# Altium schematic sheet Top2.SchDoc
size A3
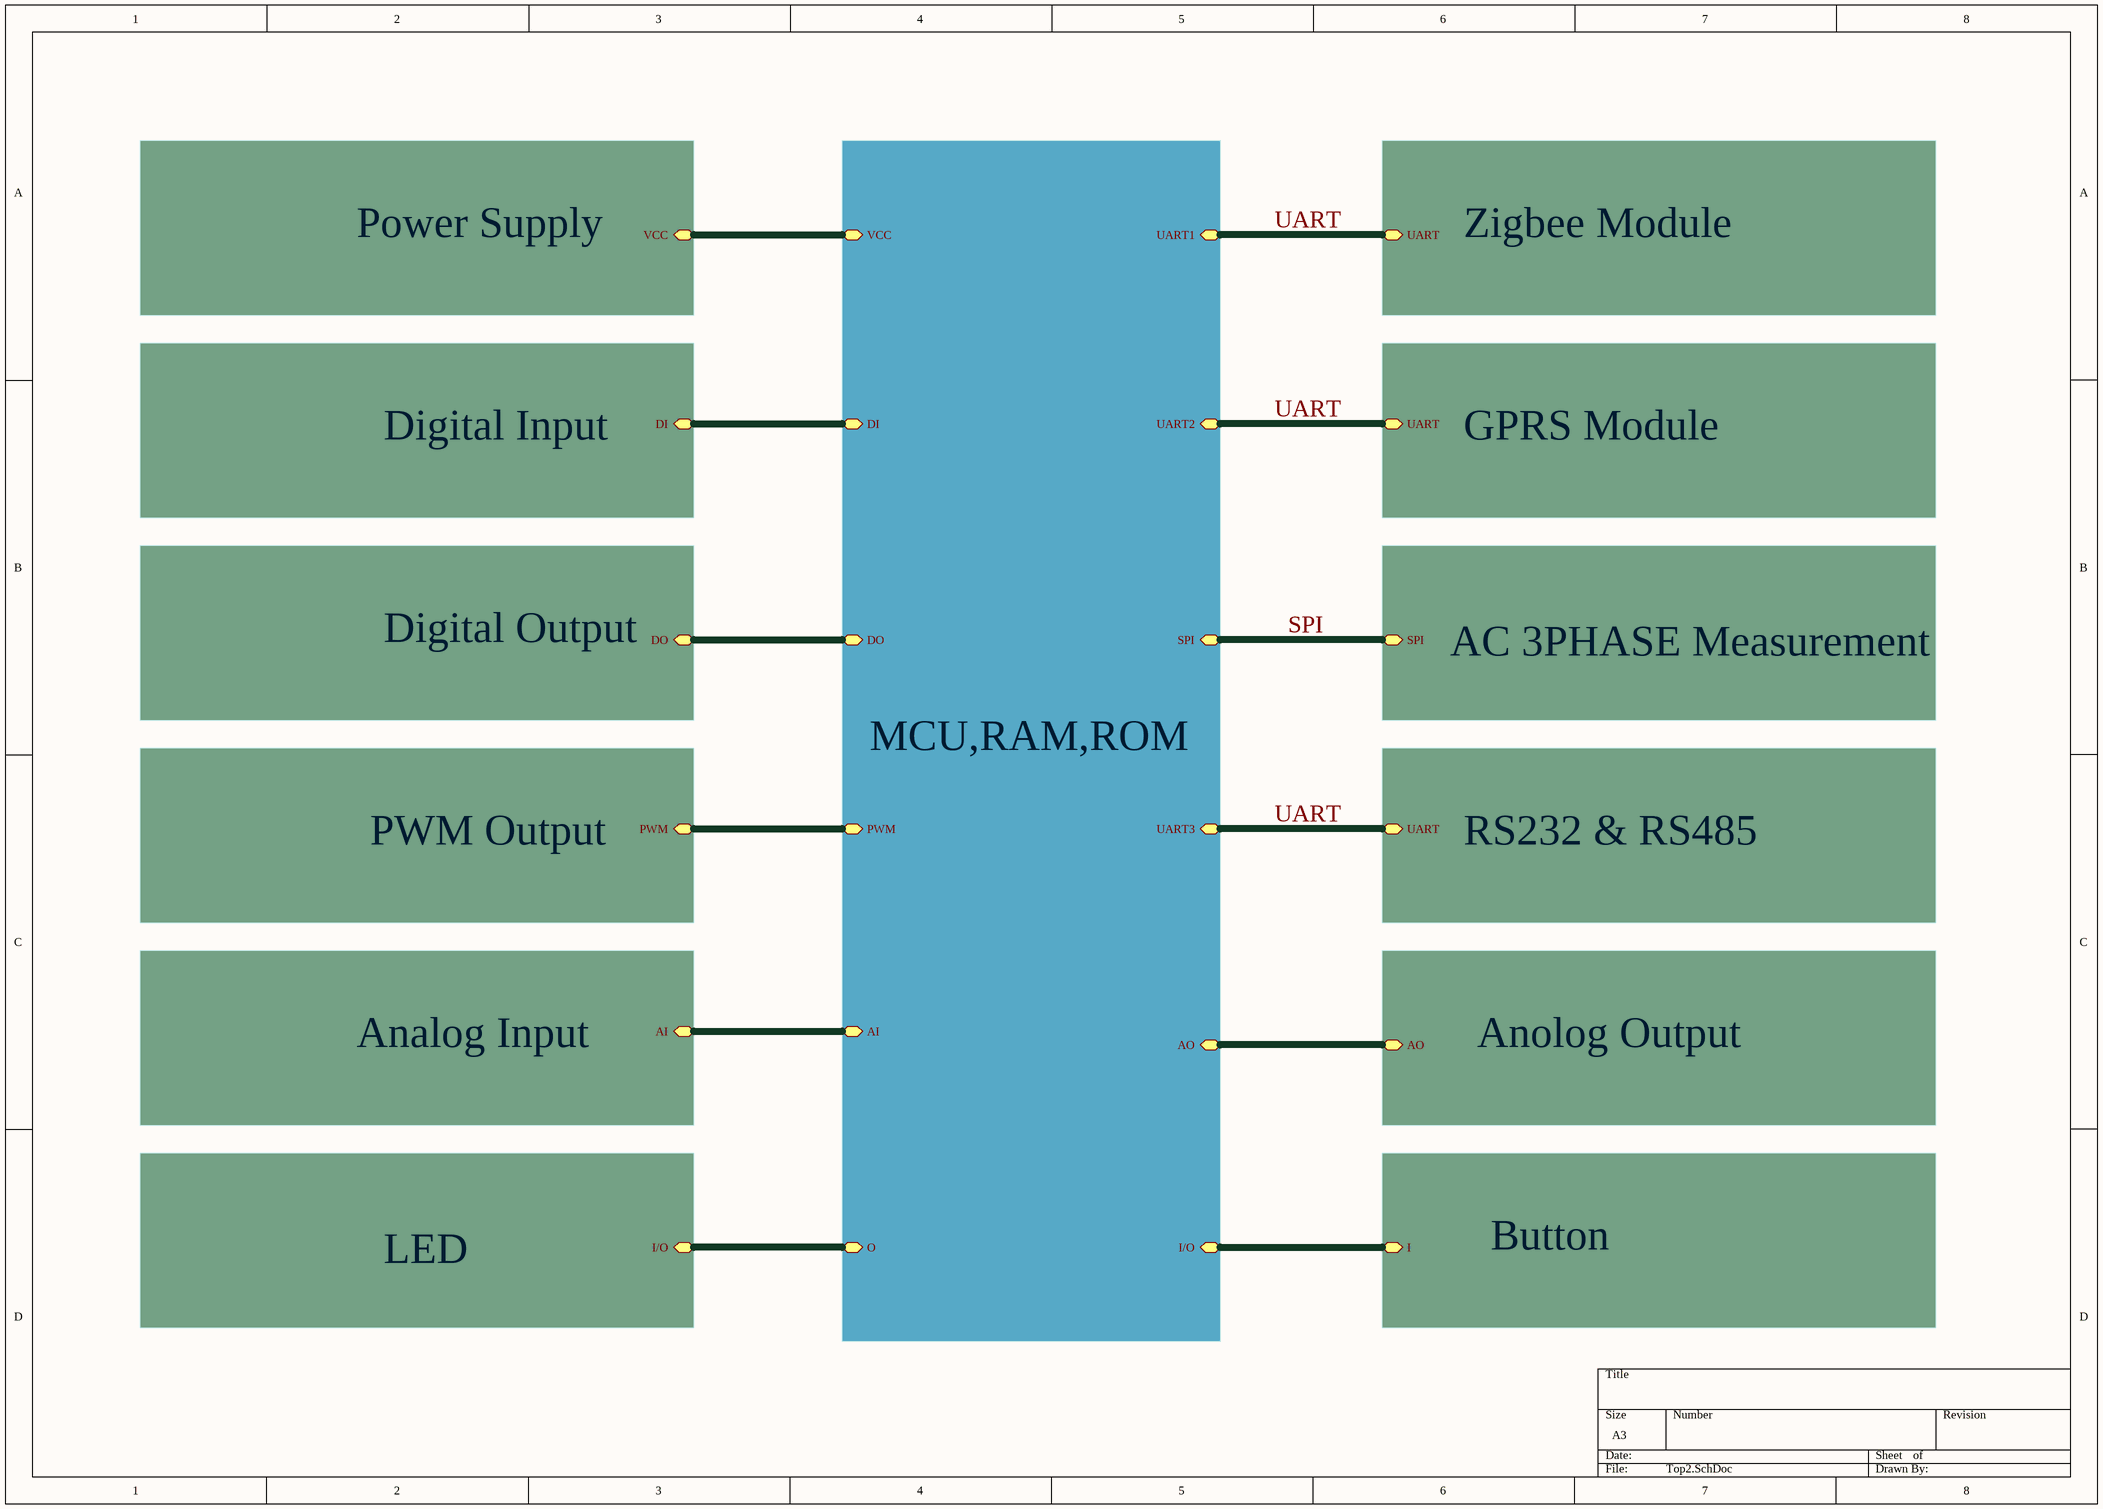
[diagram p0: Top2.SchDoc]

## Sub-sheets
AC 3PHASE Measurement = ?: SPI
Analog Input = ?: AI
Anolog Output = ?: AO
Button = ?: I
Digital Input = ?: DI
Digital Output = ?: DO
GPRS Module = ?: UART
LED = ?: I/O
MCU,RAM,ROM = ?: DI, DO, PWM, AI, O, AO, UART3, SPI, UART2, UART1, I/O, VCC
Power Supply = ?: VCC
PWM Output = ?: PWM
RS232 & RS485 = ?: UART
Zigbee Module = ?: UART

## Nets
SPI: sheet MCU,RAM,ROM/SPI, sheet AC 3PHASE Measurement/SPI
UART: sheet MCU,RAM,ROM/UART3, sheet MCU,RAM,ROM/UART2, sheet MCU,RAM,ROM/UART1, sheet GPRS Module/UART, sheet RS232 & RS485/UART, sheet Zigbee Module/UART
(unnamed): sheet MCU,RAM,ROM/DI, sheet Digital Input/DI
(unnamed): sheet MCU,RAM,ROM/DO, sheet Digital Output/DO
(unnamed): sheet MCU,RAM,ROM/PWM, sheet PWM Output/PWM
(unnamed): sheet MCU,RAM,ROM/AI, sheet Analog Input/AI
(unnamed): sheet MCU,RAM,ROM/O, sheet LED/I/O
(unnamed): sheet MCU,RAM,ROM/AO, sheet Anolog Output/AO
(unnamed): sheet MCU,RAM,ROM/I/O, sheet Button/I
(unnamed): sheet MCU,RAM,ROM/VCC, sheet Power Supply/VCC